# Altium schematic sheet Display.SchDoc
size A3; SheetNumber: 1; SheetTotal: 1; SPICEModelCacheNQQEVJMB: <root> / <DocumentId>NQQEVJMB</DocumentId> / </root>
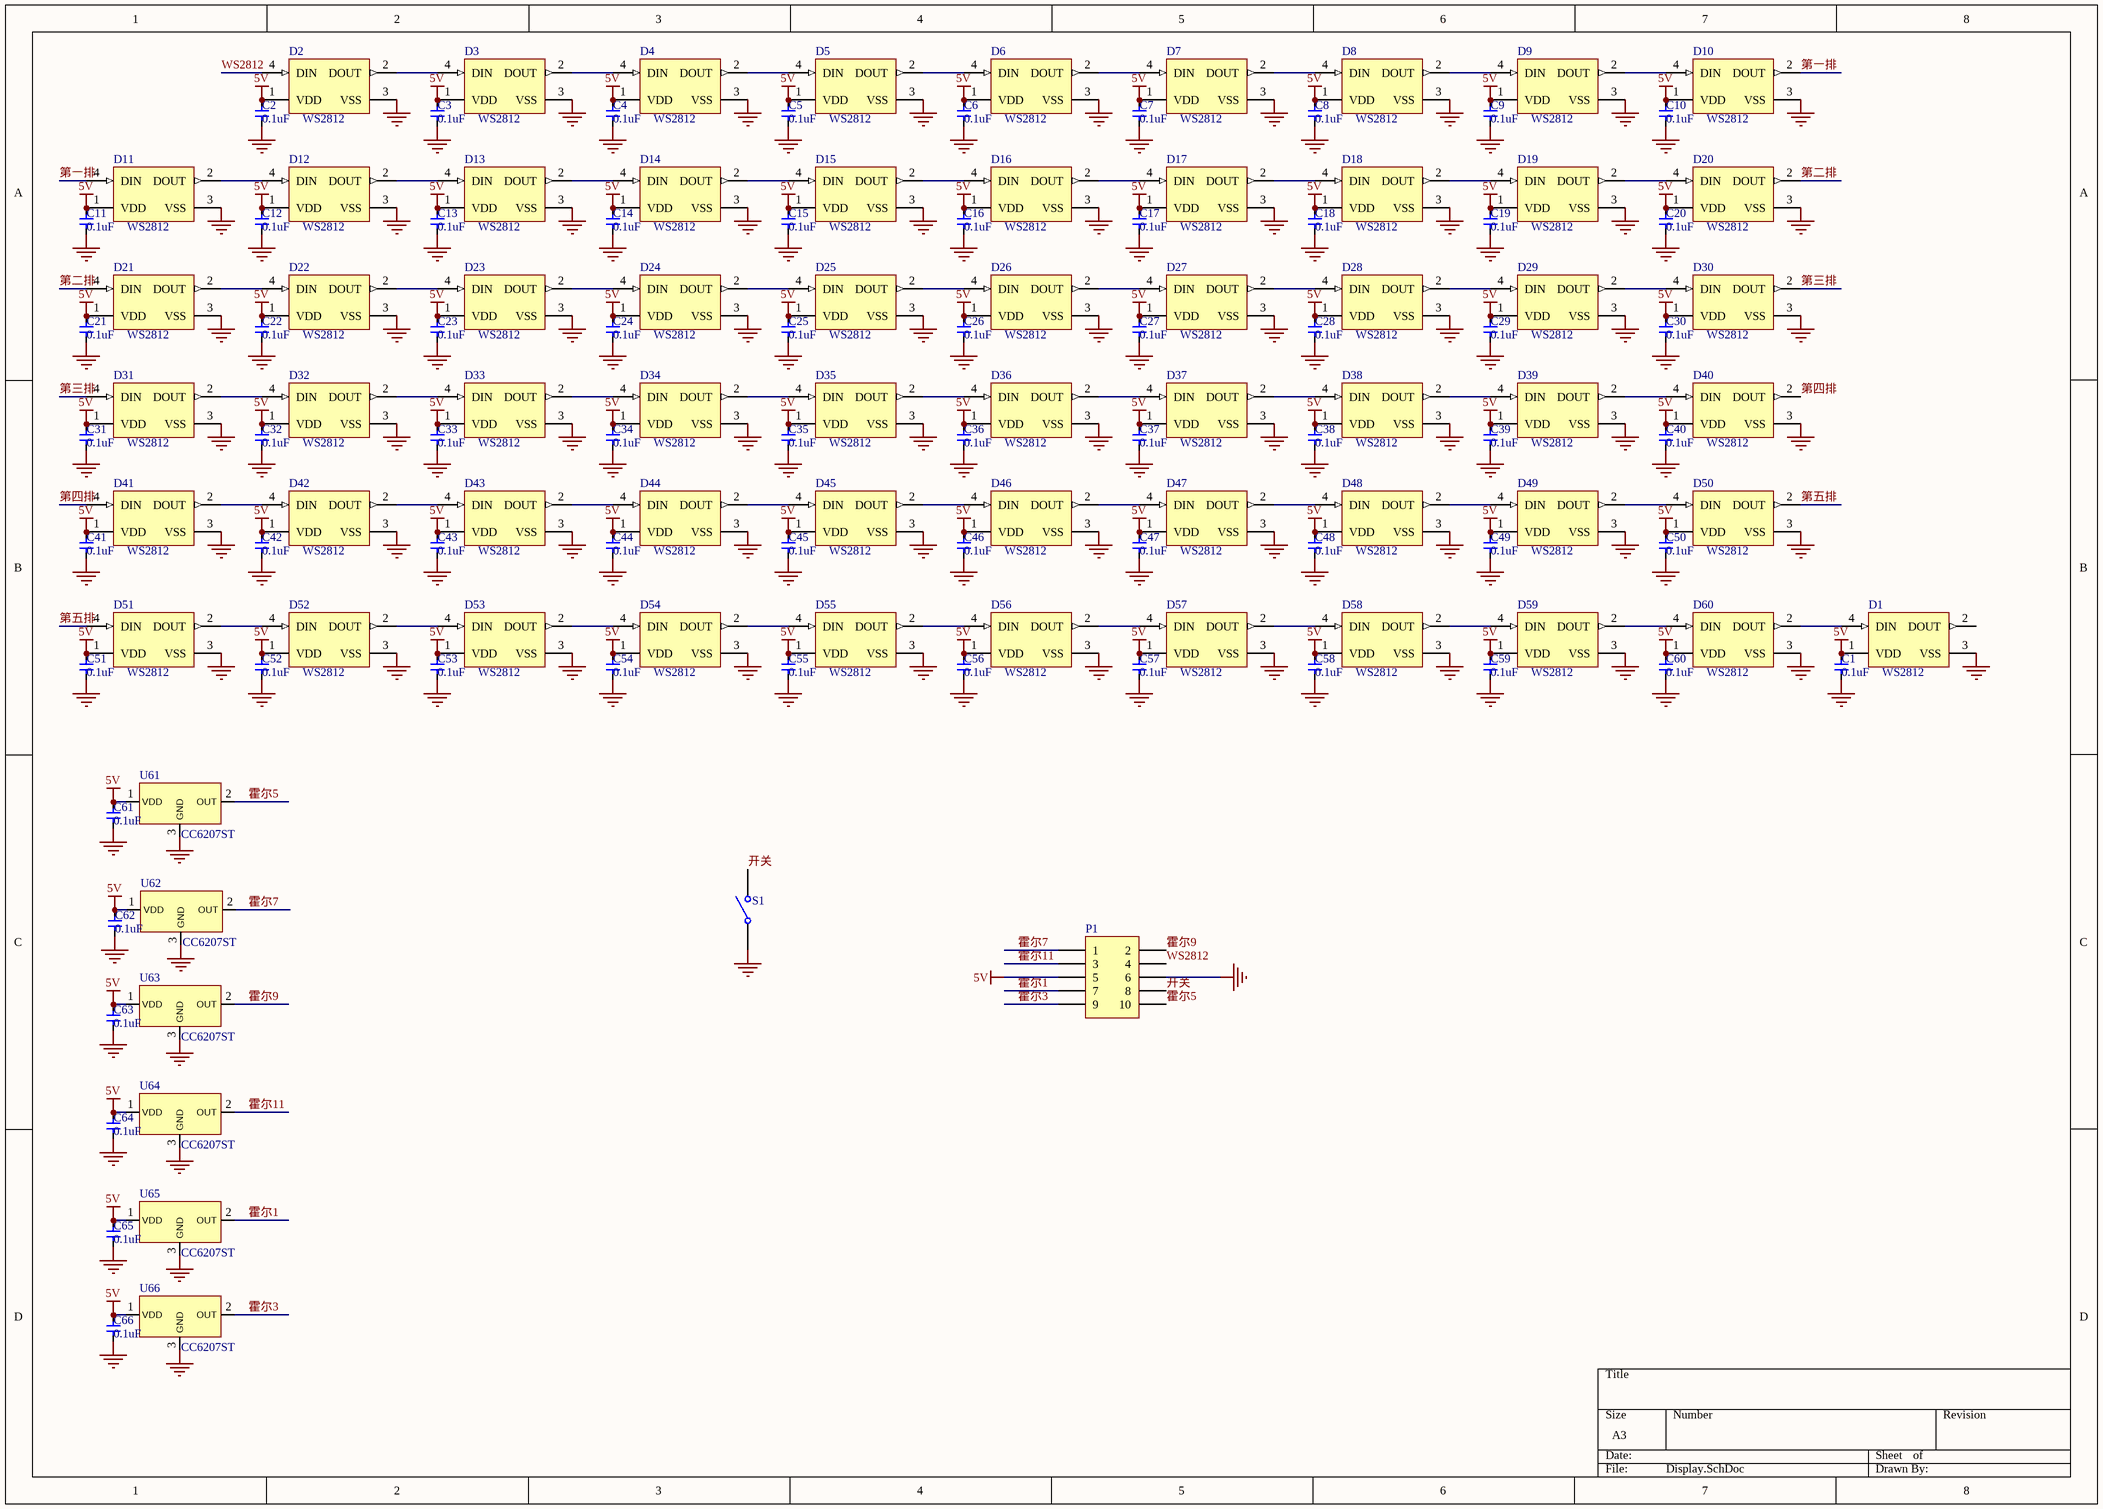
[diagram p0: Display.SchDoc]

## Parts
C1  0.1uF  [0603_C]
C2  0.1uF  [0603_C]
C3  0.1uF  [0603_C]
C4  0.1uF  [0603_C]
C5  0.1uF  [0603_C]
C6  0.1uF  [0603_C]
C7  0.1uF  [0603_C]
C8  0.1uF  [0603_C]
C9  0.1uF  [0603_C]
C10  0.1uF  [0603_C]
C11  0.1uF  [0603_C]
C12  0.1uF  [0603_C]
C13  0.1uF  [0603_C]
C14  0.1uF  [0603_C]
C15  0.1uF  [0603_C]
C16  0.1uF  [0603_C]
C17  0.1uF  [0603_C]
C18  0.1uF  [0603_C]
C19  0.1uF  [0603_C]
C20  0.1uF  [0603_C]
C21  0.1uF  [0603_C]
C22  0.1uF  [0603_C]
C23  0.1uF  [0603_C]
C24  0.1uF  [0603_C]
C25  0.1uF  [0603_C]
C26  0.1uF  [0603_C]
C27  0.1uF  [0603_C]
C28  0.1uF  [0603_C]
C29  0.1uF  [0603_C]
C30  0.1uF  [0603_C]
C31  0.1uF  [0603_C]
C32  0.1uF  [0603_C]
C33  0.1uF  [0603_C]
C34  0.1uF  [0603_C]
C35  0.1uF  [0603_C]
C36  0.1uF  [0603_C]
C37  0.1uF  [0603_C]
C38  0.1uF  [0603_C]
C39  0.1uF  [0603_C]
C40  0.1uF  [0603_C]
C41  0.1uF  [0603_C]
C42  0.1uF  [0603_C]
C43  0.1uF  [0603_C]
C44  0.1uF  [0603_C]
C45  0.1uF  [0603_C]
C46  0.1uF  [0603_C]
C47  0.1uF  [0603_C]
C48  0.1uF  [0603_C]
C49  0.1uF  [0603_C]
C50  0.1uF  [0603_C]
C51  0.1uF  [0603_C]
C52  0.1uF  [0603_C]
C53  0.1uF  [0603_C]
C54  0.1uF  [0603_C]
C55  0.1uF  [0603_C]
C56  0.1uF  [0603_C]
C57  0.1uF  [0603_C]
C58  0.1uF  [0603_C]
C59  0.1uF  [0603_C]
C60  0.1uF  [0603_C]
C61  0.1uF  [0603_C]
C62  0.1uF  [0603_C]
C63  0.1uF  [0603_C]
C64  0.1uF  [0603_C]
C65  0.1uF  [0603_C]
C66  0.1uF  [0603_C]
D1  WS2812  [WS2812-2020]
D2  WS2812  [WS2812-2020]
D3  WS2812  [WS2812-2020]
D4  WS2812  [WS2812-2020]
D5  WS2812  [WS2812-2020]
D6  WS2812  [WS2812-2020]
D7  WS2812  [WS2812-2020]
D8  WS2812  [WS2812-2020]
D9  WS2812  [WS2812-2020]
D10  WS2812  [WS2812-2020]
D11  WS2812  [WS2812-2020]
D12  WS2812  [WS2812-2020]
D13  WS2812  [WS2812-2020]
D14  WS2812  [WS2812-2020]
D15  WS2812  [WS2812-2020]
D16  WS2812  [WS2812-2020]
D17  WS2812  [WS2812-2020]
D18  WS2812  [WS2812-2020]
D19  WS2812  [WS2812-2020]
D20  WS2812  [WS2812-2020]
D21  WS2812  [WS2812-2020]
D22  WS2812  [WS2812-2020]
D23  WS2812  [WS2812-2020]
D24  WS2812  [WS2812-2020]
D25  WS2812  [WS2812-2020]
D26  WS2812  [WS2812-2020]
D27  WS2812  [WS2812-2020]
D28  WS2812  [WS2812-2020]
D29  WS2812  [WS2812-2020]
D30  WS2812  [WS2812-2020]
D31  WS2812  [WS2812-2020]
D32  WS2812  [WS2812-2020]
D33  WS2812  [WS2812-2020]
D34  WS2812  [WS2812-2020]
D35  WS2812  [WS2812-2020]
D36  WS2812  [WS2812-2020]
D37  WS2812  [WS2812-2020]
D38  WS2812  [WS2812-2020]
D39  WS2812  [WS2812-2020]
D40  WS2812  [WS2812-2020]
D41  WS2812  [WS2812-2020]
D42  WS2812  [WS2812-2020]
D43  WS2812  [WS2812-2020]
D44  WS2812  [WS2812-2020]
D45  WS2812  [WS2812-2020]
D46  WS2812  [WS2812-2020]
D47  WS2812  [WS2812-2020]
D48  WS2812  [WS2812-2020]
D49  WS2812  [WS2812-2020]
D50  WS2812  [WS2812-2020]
D51  WS2812  [WS2812-2020]
D52  WS2812  [WS2812-2020]
D53  WS2812  [WS2812-2020]
D54  WS2812  [WS2812-2020]
D55  WS2812  [WS2812-2020]
D56  WS2812  [WS2812-2020]
D57  WS2812  [WS2812-2020]
D58  WS2812  [WS2812-2020]
D59  WS2812  [WS2812-2020]
D60  WS2812  [WS2812-2020]
P1  Header 5X2  [GoldFinger-2.54-5x2]  (value not drawn)
S1  SW-SPST  [contactor]  (value not drawn)
U61  CC6207ST  [SOT23-3]
U62  CC6207ST  [SOT23-3]
U63  CC6207ST  [SOT23-3]
U64  CC6207ST  [SOT23-3]
U65  CC6207ST  [SOT23-3]
U66  CC6207ST  [SOT23-3]

## Nets
5V: C1.2 C2.2 C3.2 C4.2 C5.2 C6.2 C7.2 C8.2 C9.2 C10.2 C11.2 C12.2 C13.2 C14.2 C15.2 C16.2 C17.2 C18.2 C19.2 C20.2 C21.2 C22.2 C23.2 C24.2 C25.2 C26.2 C27.2 C28.2 C29.2 C30.2 C31.2 C32.2 C33.2 C34.2 C35.2 C36.2 C37.2 C38.2 C39.2 C40.2 C41.2 C42.2 C43.2 C44.2 C45.2 C46.2 C47.2 C48.2 C49.2 C50.2 C51.2 C52.2 C53.2 C54.2 C55.2 C56.2 C57.2 C58.2 C59.2 C60.2 C61.2 C62.2 C63.2 C64.2 C65.2 C66.2 D1.1(VDD) D2.1(VDD) D3.1(VDD) D4.1(VDD) D5.1(VDD) D6.1(VDD) D7.1(VDD) D8.1(VDD) D9.1(VDD) D10.1(VDD) D11.1(VDD) D12.1(VDD) D13.1(VDD) D14.1(VDD) D15.1(VDD) D16.1(VDD) D17.1(VDD) D18.1(VDD) D19.1(VDD) D20.1(VDD) D21.1(VDD) D22.1(VDD) D23.1(VDD) D24.1(VDD) D25.1(VDD) D26.1(VDD) D27.1(VDD) D28.1(VDD) D29.1(VDD) D30.1(VDD) D31.1(VDD) D32.1(VDD) D33.1(VDD) D34.1(VDD) D35.1(VDD) D36.1(VDD) D37.1(VDD) D38.1(VDD) D39.1(VDD) D40.1(VDD) D41.1(VDD) D42.1(VDD) D43.1(VDD) D44.1(VDD) D45.1(VDD) D46.1(VDD) D47.1(VDD) D48.1(VDD) D49.1(VDD) D50.1(VDD) D51.1(VDD) D52.1(VDD) D53.1(VDD) D54.1(VDD) D55.1(VDD) D56.1(VDD) D57.1(VDD) D58.1(VDD) D59.1(VDD) D60.1(VDD) P1.5 U61.1(VDD) U62.1(VDD) U63.1(VDD) U64.1(VDD) U65.1(VDD) U66.1(VDD)
GND: C1.1 C2.1 C3.1 C4.1 C5.1 C6.1 C7.1 C8.1 C9.1 C10.1 C11.1 C12.1 C13.1 C14.1 C15.1 C16.1 C17.1 C18.1 C19.1 C20.1 C21.1 C22.1 C23.1 C24.1 C25.1 C26.1 C27.1 C28.1 C29.1 C30.1 C31.1 C32.1 C33.1 C34.1 C35.1 C36.1 C37.1 C38.1 C39.1 C40.1 C41.1 C42.1 C43.1 C44.1 C45.1 C46.1 C47.1 C48.1 C49.1 C50.1 C51.1 C52.1 C53.1 C54.1 C55.1 C56.1 C57.1 C58.1 C59.1 C60.1 C61.1 C62.1 C63.1 C64.1 C65.1 C66.1 D1.3(VSS) D2.3(VSS) D3.3(VSS) D4.3(VSS) D5.3(VSS) D6.3(VSS) D7.3(VSS) D8.3(VSS) D9.3(VSS) D10.3(VSS) D11.3(VSS) D12.3(VSS) D13.3(VSS) D14.3(VSS) D15.3(VSS) D16.3(VSS) D17.3(VSS) D18.3(VSS) D19.3(VSS) D20.3(VSS) D21.3(VSS) D22.3(VSS) D23.3(VSS) D24.3(VSS) D25.3(VSS) D26.3(VSS) D27.3(VSS) D28.3(VSS) D29.3(VSS) D30.3(VSS) D31.3(VSS) D32.3(VSS) D33.3(VSS) D34.3(VSS) D35.3(VSS) D36.3(VSS) D37.3(VSS) D38.3(VSS) D39.3(VSS) D40.3(VSS) D41.3(VSS) D42.3(VSS) D43.3(VSS) D44.3(VSS) D45.3(VSS) D46.3(VSS) D47.3(VSS) D48.3(VSS) D49.3(VSS) D50.3(VSS) D51.3(VSS) D52.3(VSS) D53.3(VSS) D54.3(VSS) D55.3(VSS) D56.3(VSS) D57.3(VSS) D58.3(VSS) D59.3(VSS) D60.3(VSS) P1.6 S1.1(COMMON) U61.3(GND) U62.3(GND) U63.3(GND) U64.3(GND) U65.3(GND) U66.3(GND)
WS2812: D2.4(DIN) P1.4
开关: P1.8 S1.2(NO)
第一排: D10.2(DOUT) D11.4(DIN)
第三排: D30.2(DOUT) D31.4(DIN)
第二排: D20.2(DOUT) D21.4(DIN)
第五排: D50.2(DOUT) D51.4(DIN)
第四排: D40.2(DOUT) D41.4(DIN)
霍尔1: P1.7 U65.2(OUT)
霍尔3: P1.9 U66.2(OUT)
霍尔5: P1.10 U61.2(OUT)
霍尔7: P1.1 U62.2(OUT)
霍尔9: P1.2 U63.2(OUT)
霍尔11: P1.3 U64.2(OUT)
NetD1_4: D1.4(DIN) D60.2(DOUT)
NetD2_2: D2.2(DOUT) D3.4(DIN)
NetD3_2: D3.2(DOUT) D4.4(DIN)
NetD4_2: D4.2(DOUT) D5.4(DIN)
NetD5_2: D5.2(DOUT) D6.4(DIN)
NetD6_2: D6.2(DOUT) D7.4(DIN)
NetD7_2: D7.2(DOUT) D8.4(DIN)
NetD8_2: D8.2(DOUT) D9.4(DIN)
NetD9_2: D9.2(DOUT) D10.4(DIN)
NetD11_2: D11.2(DOUT) D12.4(DIN)
NetD12_2: D12.2(DOUT) D13.4(DIN)
NetD13_2: D13.2(DOUT) D14.4(DIN)
NetD14_2: D14.2(DOUT) D15.4(DIN)
NetD15_2: D15.2(DOUT) D16.4(DIN)
NetD16_2: D16.2(DOUT) D17.4(DIN)
NetD17_2: D17.2(DOUT) D18.4(DIN)
NetD18_2: D18.2(DOUT) D19.4(DIN)
NetD19_2: D19.2(DOUT) D20.4(DIN)
NetD21_2: D21.2(DOUT) D22.4(DIN)
NetD22_2: D22.2(DOUT) D23.4(DIN)
NetD23_2: D23.2(DOUT) D24.4(DIN)
NetD24_2: D24.2(DOUT) D25.4(DIN)
NetD25_2: D25.2(DOUT) D26.4(DIN)
NetD26_2: D26.2(DOUT) D27.4(DIN)
NetD27_2: D27.2(DOUT) D28.4(DIN)
NetD28_2: D28.2(DOUT) D29.4(DIN)
NetD29_2: D29.2(DOUT) D30.4(DIN)
NetD31_2: D31.2(DOUT) D32.4(DIN)
NetD32_2: D32.2(DOUT) D33.4(DIN)
NetD33_2: D33.2(DOUT) D34.4(DIN)
NetD34_2: D34.2(DOUT) D35.4(DIN)
NetD35_2: D35.2(DOUT) D36.4(DIN)
NetD36_2: D36.2(DOUT) D37.4(DIN)
NetD37_2: D37.2(DOUT) D38.4(DIN)
NetD38_2: D38.2(DOUT) D39.4(DIN)
NetD39_2: D39.2(DOUT) D40.4(DIN)
NetD41_2: D41.2(DOUT) D42.4(DIN)
NetD42_2: D42.2(DOUT) D43.4(DIN)
NetD43_2: D43.2(DOUT) D44.4(DIN)
NetD44_2: D44.2(DOUT) D45.4(DIN)
NetD45_2: D45.2(DOUT) D46.4(DIN)
NetD46_2: D46.2(DOUT) D47.4(DIN)
NetD47_2: D47.2(DOUT) D48.4(DIN)
NetD48_2: D48.2(DOUT) D49.4(DIN)
NetD49_2: D49.2(DOUT) D50.4(DIN)
NetD51_2: D51.2(DOUT) D52.4(DIN)
NetD52_2: D52.2(DOUT) D53.4(DIN)
NetD53_2: D53.2(DOUT) D54.4(DIN)
NetD54_2: D54.2(DOUT) D55.4(DIN)
NetD55_2: D55.2(DOUT) D56.4(DIN)
NetD56_2: D56.2(DOUT) D57.4(DIN)
NetD57_2: D57.2(DOUT) D58.4(DIN)
NetD58_2: D58.2(DOUT) D59.4(DIN)
NetD59_2: D59.2(DOUT) D60.4(DIN)

Not connected (* = marked no-connect by the designer): D1 2(DOUT)

## Library data of the parts
C1-C66 = 电容-0402: Capacitor; Value: 0.1u
D1-D60 = ADA-RGB-1655-4: Intelligent Control LED Integrated Light Source, 3.5 to 5.3 V, -25 to 80 degC, 4-Pin SMD, RoHS, Tape and Reel; Manufacturer: Adafruit-Industries-LLC; Number of LEDs: 10; Configuration: Discrete; Utilized LED: WS2812(5050); Color: Red,Green,Blue(RGB); Datasheet URL: http://datasheet.octopart.com/ADA1655-Adafruit-Industries-datasheet-32028139.pdf; Series: Neopixel; Interface: -; Package Description: 4-Pin Surface Mount Device, Body 5 x 5 mm; Category: Optoelectronics; Controller Type: -; Package Reference: 1655; Manufacturer URL: https://www.adafruit.com/; Mounting Type: SurfaceMount; Datasheet Version: May-13; Size / Dimension: 5.00mmLx5.00mmW; Family: Addressable,Specialty
P1 = Header 5X2: Header, 5-Pin, Dual row; LatestRevisionDate: 17-Jul-2002; LatestRevisionNote: Re-released for DXP Platform.; Publisher: Altium Limited
S1 = SW-SPST: Single-Pole, Single-Throw Switch; Published: 24-Mar-1999; LatestRevisionDate: 17-Jul-2002; LatestRevisionNote: Re-released for DXP Platform.; PackageReference: SPST-2; Publisher: Altium Limited; PackageDescription: Switch; 2 Leads
U61-U66 = CC6207ST: SOT-23 全极性锁存型微功耗霍尔效应开关传感器